# Altium schematic sheet gydrodrive_mcu.SchDoc
size 297 x 209 mm; SheetNumber: 3; SheetTotal: 22
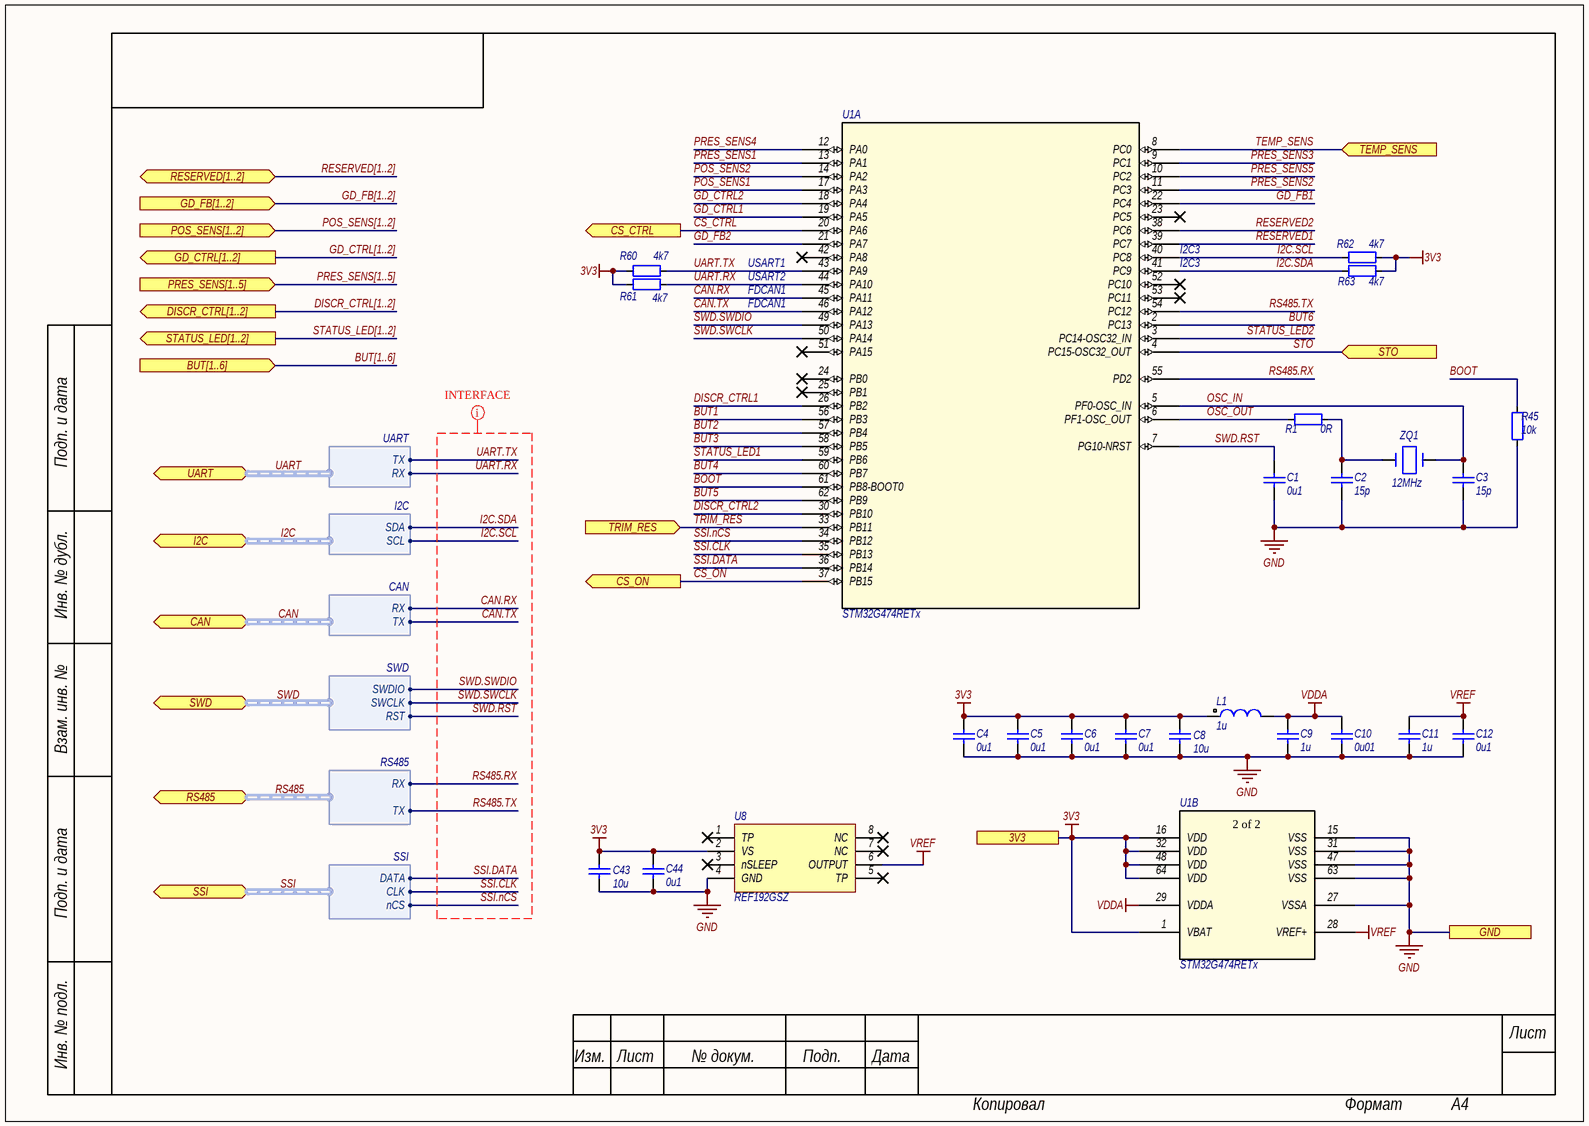
[diagram p0: gydrodrive_mcu.SchDoc]

## Parts
C1  Capacitance: 0u1  [CAPC2012-0805M]  (hidden comment: CAP_0805)
C2  Capacitance: 15p  [CAPC2012-0805M]  (hidden comment: CAP_0805)
C3  Capacitance: 15p  [CAPC2012-0805M]  (hidden comment: CAP_0805)
C4  Capacitance: 0u1  [CAPC2012-0805M]  (hidden comment: CAP_0805)
C5  Capacitance: 0u1  [CAPC2012-0805M]  (hidden comment: CAP_0805)
C6  Capacitance: 0u1  [CAPC2012-0805M]  (hidden comment: CAP_0805)
C7  Capacitance: 0u1  [CAPC2012-0805M]  (hidden comment: CAP_0805)
C8  Capacitance: 10u  [CAPC2012-0805M]  (hidden comment: CAP_0805)
C9  Capacitance: 1u  [CAPC2012-0805M]  (hidden comment: CAP_0805)
C10  Capacitance: 0u01  [CAPC2012-0805M]  (hidden comment: CAP_0805)
C11  Capacitance: 1u  [CAPC2012-0805M]  (hidden comment: CAP_0805)
C12  Capacitance: 0u1  [CAPC2012-0805M]  (hidden comment: CAP_0805)
C43  Capacitance: 10u  [CAPC2012-0805M]  (hidden comment: CAP_0805)
C44  Capacitance: 0u1  [CAPC2012-0805M]  (hidden comment: CAP_0805)
L1  Inductance: 1u  [INDC2012-0805M]  (hidden comment: IND_0805)
R1  Resistance: 0R  [RESC2012-0805M]  (hidden comment: RES_0805)
R45  Resistance: 10k  [RESC2012-0805M]  (hidden comment: RES_0805)
R60  Resistance: 4k7  [RESC2012-0805M]  (hidden comment: RES_0805)
R61  Resistance: 4k7  [RESC2012-0805M]  (hidden comment: RES_0805)
R62  Resistance: 4k7  [RESC2012-0805M]  (hidden comment: RES_0805)
R63  Resistance: 4k7  [RESC2012-0805M]  (hidden comment: RES_0805)
U1  STM32G474RETx  [LQFP50P1200X1200X160-64M]  (parts A,B of 2)
U8  REF192GSZ  [SO8_M]
ZQ1  Parameters: 12MHz  [HC-49SMD]  (hidden comment: QRZ_HC_49_SMD)

## Ports
3V3 (see gydrodrive_main[2C], gydrodrive_button[2B], gydrodrive_can[2B], gydrodrive_debugger[2B], gydrodrive_encoder[1A], gydrodrive_indication[3C], gydrodrive_inputTrim[2B], gydrodrive_interfaces[2C], gydrodrive_rs485[3B], gydrodrive_sto[2B], gydrodrive_supply[3C]), BUT[1..6] (in, see gydrodrive_main[3B]), CAN (bidir, harness CAN, see gydrodrive_main[2A], gydrodrive_can[1C], gydrodrive_interfaces[3D]), CS_CTRL (out, see gydrodrive_main[2B], gydrodrive_currentSource[3C]), CS_ON (out, see gydrodrive_main[2B], gydrodrive_currentSource[1C]), DISCR_CTRL[1..2] (out, see gydrodrive_main[2B], gydrodrive_discreteControl[1C]), GD_CTRL[1..2] (out, see gydrodrive_main[3A]), GD_FB[1..2] (in, see gydrodrive_main[3A]), GND (see gydrodrive_main[2D], gydrodrive_button[2C], gydrodrive_can[2C], gydrodrive_control[2C], gydrodrive_currentSource[1B], gydrodrive_debugger[3C], gydrodrive_discreteControl[2B], gydrodrive_encoder[1B], gydrodrive_i2c[3C], gydrodrive_indication[3C], gydrodrive_inputTrim[2C], gydrodrive_interfaces[2A], gydrodrive_linearPosSensor[2C], gydrodrive_reservedPins[2C], gydrodrive_rs485[2B], gydrodrive_sensor[2C], gydrodrive_sensors[1B], gydrodrive_sto[2C], gydrodrive_supply[2C], gydrodrive_uart[2C]), I2C (bidir, harness I2C, see gydrodrive_main[2A], gydrodrive_i2c[1C], gydrodrive_interfaces[3A]), POS_SENS[1..2] (in, see gydrodrive_main[2B], gydrodrive_sensors[3B]), PRES_SENS[1..5] (in, see gydrodrive_main[2B], gydrodrive_sensors[3B]), RESERVED[1..2] (bidir, see gydrodrive_main[3C], gydrodrive_reservedPins[2B]), RS485 (bidir, harness RS485, see gydrodrive_main[2A], gydrodrive_interfaces[3C], gydrodrive_rs485[1B]), SSI (bidir, harness SSI, see gydrodrive_main[3D], gydrodrive_encoder[1D]), STATUS_LED[1..2] (out, see gydrodrive_main[3B], gydrodrive_indication[2B]), STO (in, see gydrodrive_main[3C], gydrodrive_sto[2B]), SWD (bidir, harness SWD, see gydrodrive_main[3A], gydrodrive_debugger[1B]), TEMP_SENS (in, see gydrodrive_main[2C], gydrodrive_sensors[3C]), TRIM_RES (in, see gydrodrive_main[3B], gydrodrive_inputTrim[2C]), UART (bidir, harness UART, see gydrodrive_main[2A], gydrodrive_interfaces[3B], gydrodrive_uart[2B])

## Harnesses
UART: RX, TX
CAN: TX, RX
I2C: SDA, SCL
SWD: SWDIO, SWCLK, RST
SSI: DATA, CLK, nCS
RS485: RX, TX

## Nets
3V3: C4.2 C5.2 C6.2 C7.2 C8.2 C43.2 C44.2 L1.1 R60.2 R61.2 R62.1 R63.1 U1.1(VBAT) U1.16(VDD) U1.32(VDD) U1.48(VDD) U1.64(VDD) U8.2(VS) ; port 3V3
GND: C1.1 C2.1 C3.1 C4.1 C5.1 C6.1 C7.1 C8.1 C9.1 C10.1 C11.1 C12.1 C43.1 C44.1 R45.1 U1.15(VSS) U1.27(VSSA) U1.31(VSS) U1.47(VSS) U1.63(VSS) U8.4(GND) ; port GND
VDDA: C9.2 C10.2 L1.2 U1.29(VDDA)
VREF: C11.2 C12.2 U1.28(VREF+) U8.6(OUTPUT)
BOOT: R45.2 U1.61(PB8-BOOT0)
BUT1: U1.56(PB3)
BUT2: U1.57(PB4)
BUT3: U1.58(PB5)
BUT4: U1.60(PB7)
BUT5: U1.62(PB9)
BUT6: U1.2(PC13)
CAN.RX: U1.45(PA11) ; port CAN.RX
CAN.TX: U1.46(PA12) ; port CAN.TX
CS_CTRL: U1.20(PA6) ; port CS_CTRL
CS_ON: U1.37(PB15) ; port CS_ON
DISCR_CTRL1: U1.26(PB2)
DISCR_CTRL2: U1.30(PB10)
GD_CTRL1: U1.19(PA5)
GD_CTRL2: U1.18(PA4)
GD_FB1: U1.22(PC4)
GD_FB2: U1.21(PA7)
I2C.SCL: R62.2 U1.40(PC8) ; port I2C.SCL
I2C.SDA: R63.2 U1.41(PC9) ; port I2C.SDA
OSC_IN: C3.2 U1.5(PF0-OSC_IN) ZQ1.2
OSC_OUT: R1.1 U1.6(PF1-OSC_OUT)
POS_SENS1: U1.17(PA3)
POS_SENS2: U1.14(PA2)
PRES_SENS1: U1.13(PA1)
PRES_SENS2: U1.11(PC3)
PRES_SENS3: U1.9(PC1)
PRES_SENS4: U1.12(PA0)
PRES_SENS5: U1.10(PC2)
RESERVED1: U1.39(PC7)
RESERVED2: U1.38(PC6)
RS485.RX: U1.55(PD2) ; port RS485.RX
RS485.TX: U1.54(PC12) ; port RS485.TX
SSI.CLK: U1.35(PB13) ; port SSI.CLK
SSI.DATA: U1.36(PB14) ; port SSI.DATA
SSI.nCS: U1.34(PB12) ; port SSI.nCS
STATUS_LED1: U1.59(PB6)
STATUS_LED2: U1.3(PC14-OSC32_IN)
STO: U1.4(PC15-OSC32_OUT) ; port STO
SWD.RST: C1.2 U1.7(PG10-NRST) ; port SWD.RST
SWD.SWCLK: U1.50(PA14) ; port SWD.SWCLK
SWD.SWDIO: U1.49(PA13) ; port SWD.SWDIO
TEMP_SENS: U1.8(PC0) ; port TEMP_SENS
TRIM_RES: U1.33(PB11) ; port TRIM_RES
UART.RX: R61.1 U1.44(PA10) ; port UART.RX
UART.TX: R60.1 U1.43(PA9) ; port UART.TX
NetC2_2: C2.2 R1.2 ZQ1.1

Not connected (* = marked no-connect by the designer): U1 23(PC5)* 24(PB0)* 25(PB1)* 42(PA8)* 51(PA15)* 52(PC10)* 53(PC11)*; U8 1(TP)* 3(nSLEEP)* 5(TP)* 7(NC)* 8(NC)*

## Buses and harness runs
bus BUT[1..6] = port BUT[1..6]
bus DISCR_CTRL[1..2] = port DISCR_CTRL[1..2]
bus GD_CTRL[1..2] = port GD_CTRL[1..2]
bus GD_FB[1..2] = port GD_FB[1..2]
bus POS_SENS[1..2] = port POS_SENS[1..2]
bus PRES_SENS[1..5] = port PRES_SENS[1..5]
bus RESERVED[1..2] = port RESERVED[1..2]
bus STATUS_LED[1..2] = port STATUS_LED[1..2]
harness CAN = port CAN
harness I2C = port I2C
harness RS485 = port RS485
harness SSI = port SSI
harness SWD = port SWD
harness UART = port UART

## Layout directives
net class INTERFACE: CAN.RX, CAN.TX, I2C.SCL, I2C.SDA, RS485.RX, RS485.TX, SSI.CLK, SSI.DATA, SSI.nCS, SWD.RST, SWD.SWCLK, SWD.SWDIO, UART.RX, UART.TX

## Notes on the sheet
- USART1
- (near U1) I2C3
- FDCAN1
- USART2
- Подп. и дата
- Инв. № дубл.
- Взам. инв. №
- Инв. № подл.
- Изм.
- Лист
- № докум.
- Подп.
- Дата
- Копировал
- Формат
- A4
- (in symbol STM32G474RETx, part B) 2 of 2

## Library data of the parts
C1 C4-C7 C12 C44 = CAPC_0805: Конденсатор керамический, корпус 0805; Parameters: 0u1,  50V; Voltage: 50V; Max Price: 5; Part Number: CAPC_0805; Part Name: ='Конд-р керам. 0805,  '  + Parameters; Component Type: Standart; Pin Count: 2
C2 C3 = CAPC_0805: Конденсатор керамический, корпус 0805; Parameters: 15p,  50V; Voltage: 50V; Max Price: 5; Part Number: CAPC_0805; Part Name: ='Конд-р керам. 0805,  '  + Parameters; Component Type: Standart; Pin Count: 2
C8 C43 = CAPC_0805: Конденсатор керамический, корпус 0805; Parameters: 10u,  16V; Voltage: 16V; Max Price: 5; Part Number: CAPC_0805; Part Name: ='Конд-р керам. 0805,  '  + Parameters; Component Type: Standart; Pin Count: 2
C9 C11 = CAPC_0805: Конденсатор керамический, корпус 0805; Parameters: 1u,  50V; Voltage: 50V; Max Price: 5; Part Number: CAPC_0805; Part Name: ='Конд-р керам. 0805,  '  + Parameters; Component Type: Standart; Pin Count: 2
C10 = CAPC_0805: Конденсатор керамический, корпус 0805; Parameters: 0u01,  50V; Voltage: 50V; Max Price: 5; Part Number: CAPC_0805; Part Name: ='Конд-р керам. 0805,  '  + Parameters; Component Type: Standart; Pin Count: 2
L1 = INDC_0805: Индуктивность, корпус 0805; Part Name: Индуктивность smd 0805; Parameters: 1u, 100mA; Current: 100mA; Max Price: 15; Part Number: INDC_0805; Component Type: Standart; Pin Count: 2
R1 = RESC_0805: Рез-р, корпус 0805; Tolerance: 5%; Parameters: 0R, 5%; Max Price: 3; Part Number: RESC_0805; Part Name: ='Рез-р 0805, ' + Parameters; Component Type: Standart
R45 = RESC_0805: Рез-р, корпус 0805; Tolerance: 5%; Parameters: 10k, 5%; Max Price: 3; Part Number: RESC_0805; Part Name: ='Рез-р 0805, ' + Parameters; Component Type: Standart
R60-R63 = RESC_0805: Рез-р, корпус 0805; Tolerance: 5%; Parameters: 4k7, 5%; Max Price: 3; Part Number: RESC_0805; Part Name: ='Рез-р 0805, ' + Parameters; Component Type: Standart
U1 = STM32G474RETx: Mainstream Arm Cortex-M4 core with DSP and FPU, 170MHz with 512Kbytes of Flash memory, Math Accelerator, HR Timer, High Analog level integration; Manufacturer_Part_Number: stm32g4_lqfp64_t1; Built_By: EMA_Jessica; Vendor: STMicroelectronics; Copyright: Copyright (C) 2016 Accelerated Designs. All rights reserved; RefDes: RefDes; Type: DEV; Value: Value
U8 = REF192GSZ: Источник опорного напряжения, 2.5 В; Part Name: Микросхема REF192GSZ; Parameters: 2.5V, 0.4%; Voltage: 2.5V; Tolerance: 0.4%; Max Price: 300; Part Number: REF192GSZ; Component Type: Standart
ZQ1 = QRZ_HC_49_SMD: Кварцевый резонатор в корпусе HC-49 SMD; Part Name: Кварц. Рез-р HC-49S, 12MHz; Max Price: 50; Part Number: QRZ_HC_49_SMD; Component Type: Standart